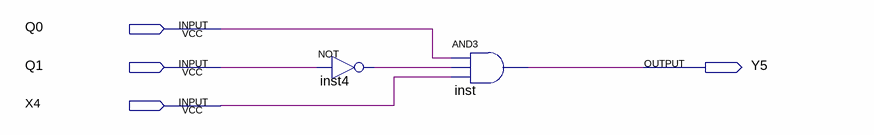
[diagram p0: schematic sheet]
// Quartus schematic Y5.bdf as structural Verilog: 2 symbols, 4 pins
module Y5 (
  input  Q0,
  input  Q1,
  input  X4,
  output Y5
);

  wire inst4_out;

  not inst4 (inst4_out, Q1);
  and inst (Y5, Q0, inst4_out, X4);
endmodule
